# EAGLE design slave-v3 (EAGLE 5.10)
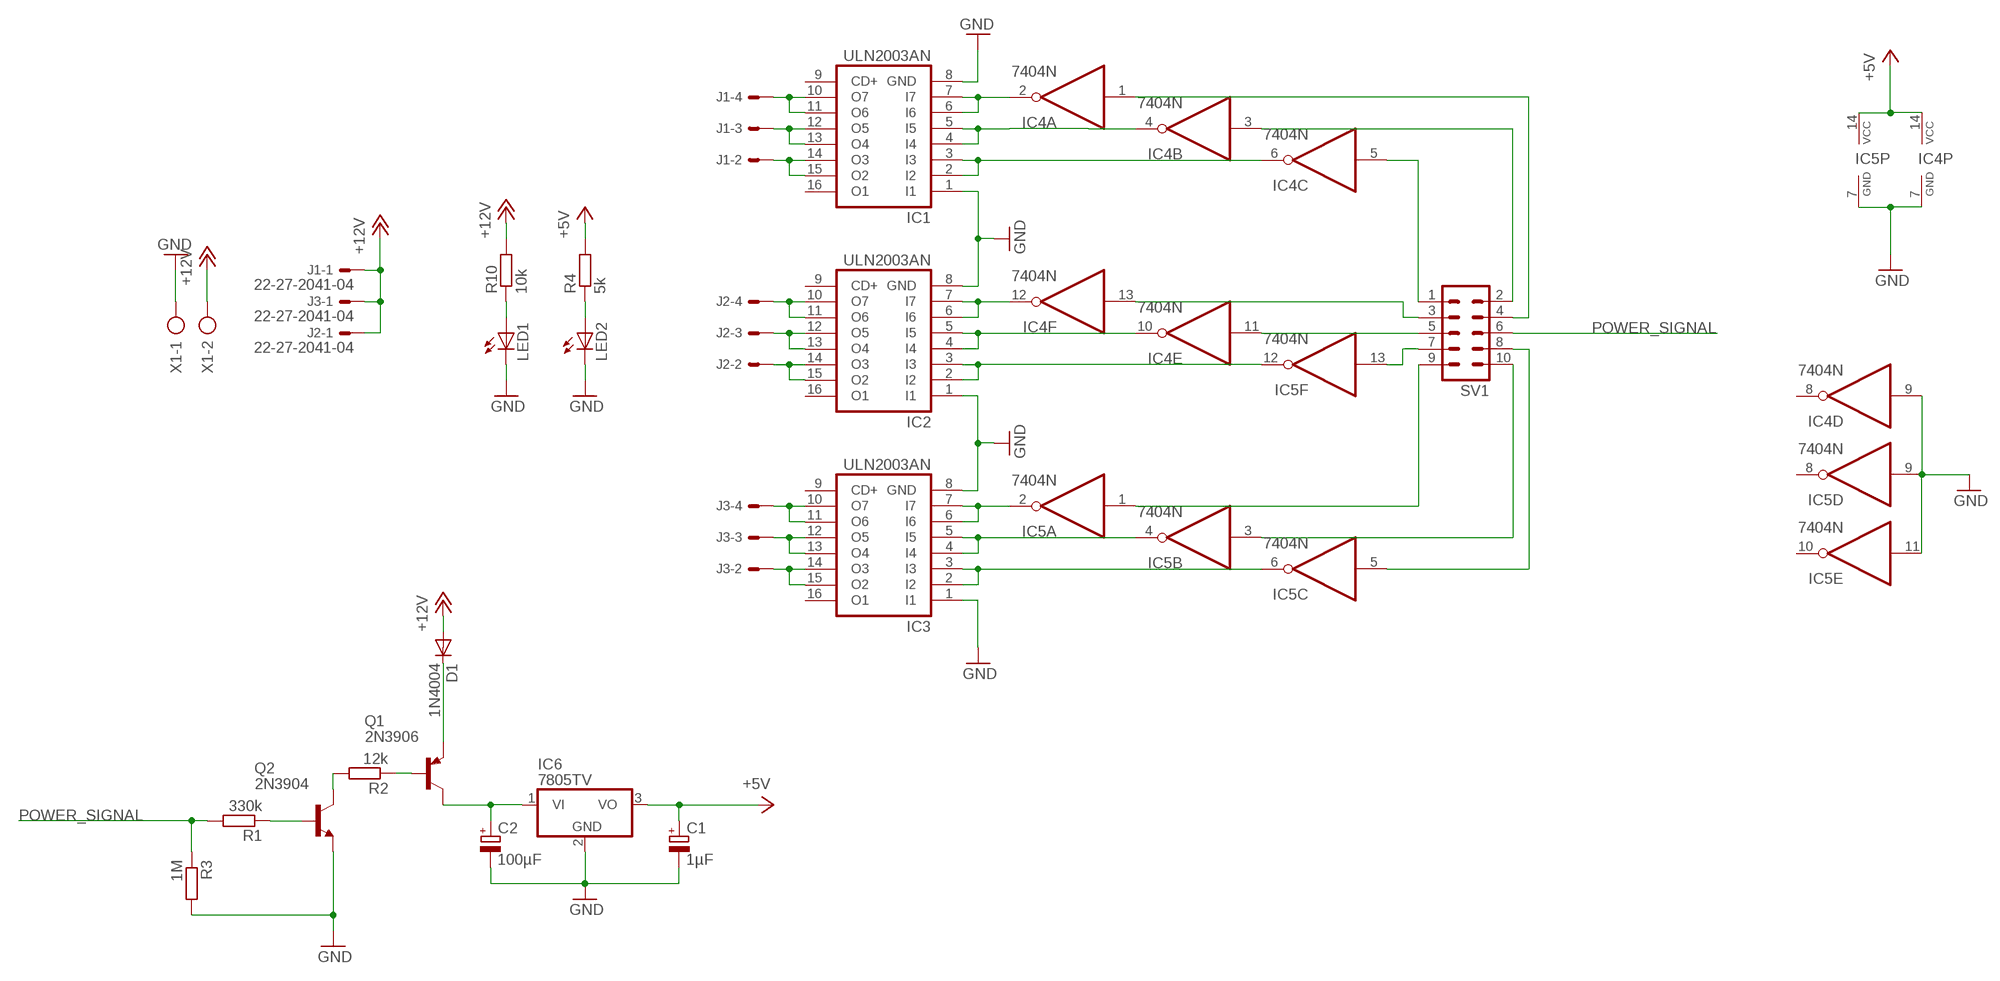
[diagram p0: schematic, sheet 1]

## Parts
C1  1µF  CPOL-EUE2.5-5  [E2,5-5]
C2  100µF  CPOL-EUE2.5-6  [E2,5-6]
D1  1N4004  [DO41-10]
IC1  ULN2003AN  [DIL16]
IC2  ULN2003AN  [DIL16]
IC3  ULN2003AN  [DIL16]
IC4  7404N  [DIL14]
IC5  7404N  [DIL14]
IC6  7805TV  [TO220V]
J1  22-27-2041-04  [6410-04]
J2  22-27-2041-04  [6410-04]
J3  22-27-2041-04  [6410-04]
LED1  LEDCHIPLED_1206  [CHIPLED_1206]
LED2  LEDCHIPLED_1206  [CHIPLED_1206]
Q1  2N3906  [TO92]
Q2  2N3904  [TO92]
R1  330k  R-EU_0204/7  [0204/7]
R2  12k  R-EU_M0805  [M0805]
R3  1M  R-EU_0204/7  [0204/7]
R4  5k  R-EU_M0805  [M0805]
R10  10k  R-EU_M0805  [M0805]
SV1  ML10  [ML10]
X1  AK500/2  [AK500/2]

## Nets
+5V: C1.+ IC4.14(P:VCC) IC5.14(P:VCC) IC6.3(VO) R4.2
+12V: D1.A J1.1 J2.1 J3.1 R10.2 X1.2
GND: C1.- C2.- IC1.1(I1) IC1.8(GND) IC2.1(I1) IC2.8(GND) IC3.1(I1) IC3.8(GND) IC4.7(P:GND) IC4.9(D:I) IC5.7(P:GND) IC5.9(D:I) IC5.11(E:I) IC6.2(GND) LED1.C LED2.C Q2.3(E) R3.2 X1.1
N$1: IC2.14(O3) IC2.15(O2) J2.2
N$2: IC2.12(O5) IC2.13(O4) J2.3
N$3: IC2.10(O7) IC2.11(O6) J2.4
N$4: IC1.14(O3) IC1.15(O2) J1.2
N$5: IC1.12(O5) IC1.13(O4) J1.3
N$6: IC1.10(O7) IC1.11(O6) J1.4
N$7: IC3.10(O7) IC3.11(O6) J3.4
N$8: IC3.12(O5) IC3.13(O4) J3.3
N$9: IC3.14(O3) IC3.15(O2) J3.2
N$10: IC5.13(F:I) SV1.7
N$11: IC4.11(E:I) SV1.5
N$12: IC4.13(F:I) SV1.3
N$13: IC4.5(C:I) SV1.1
N$14: IC4.1(A:I) SV1.4
N$15: IC4.3(B:I) SV1.2
N$16: IC1.6(I6) IC1.7(I7) IC4.2(A:O)
N$17: LED1.A R10.1
N$18: LED2.A R4.1
N$20: IC5.1(A:I) SV1.9
N$21: IC5.3(B:I) SV1.10
N$22: IC5.5(C:I) SV1.8
N$23: IC2.6(I6) IC2.7(I7) IC4.12(F:O)
N$26: IC3.6(I6) IC3.7(I7) IC5.2(A:O)
N$30: IC1.4(I4) IC1.5(I5) IC4.4(B:O)
N$31: IC1.2(I2) IC1.3(I3) IC4.6(C:O)
N$33: IC2.4(I4) IC2.5(I5) IC4.10(E:O)
N$34: IC2.2(I2) IC2.3(I3) IC5.12(F:O)
N$36: IC3.4(I4) IC3.5(I5) IC5.4(B:O)
N$37: IC3.2(I2) IC3.3(I3) IC5.6(C:O)
N$38: C2.+ IC6.1(VI) Q1.1(C)
N$39: D1.C Q1.3(E)
N$40: Q2.2(B) R1.1
N$41: Q1.2(B) R2.1
N$42: Q2.1(C) R2.2
POWER_SIGNAL: R1.2 R3.1 SV1.6
Unconnected: IC1.9(CD+) IC1.16(O1) IC2.9(CD+) IC2.16(O1) IC3.9(CD+) IC3.16(O1) IC4.8(D:O) IC5.8(D:O) IC5.10(E:O)

## Library data of the parts
C1 C2 = rcl:CPOL-EU: POLARIZED CAPACITOR, European symbol
D1 = diode:1N4004: DIODE general purpose rectifier, 1 A
IC1-IC3 = uln-udn:ULN2003A: DRIVER ARRAY
IC4 IC5 = 74xx-eu:74*04: Hex INVERTER
IC6 = linear:78*: Positive VOLTAGE REGULATOR Source: http://cache.national.com/ds/LM/LM78L05.pdf http://www.fairchildsemi.com/ds/LM/LM7805.pdf
J1-J3 = con-molex:22-?-04: CONNECTOR wire to board 2.54 mm (.1 inch) pitch header; OC_FARNELL: unknown; OC_NEWARK: unknown
LED1 LED2 = led:LED: LED OSRAM: - CHIPLED LG R971, LG N971, LY N971, LG Q971, LY Q971, LO R971, LY R971 LH N974, LH R974 LS Q976, LO Q976, LY Q976 LO Q996 - Hyper CHIPLED LW Q18S LB Q993, LB Q99A, LB R99A - SideLED LS A670, LO A670, LY A670, LG A670, LP A670 LB A673, LV A673, LT A673, LW A673 LH A674 LY A675 LS A676, LA A676, LO A676, LY A676, LW A676 LS A679, LY A679, LG A679 - Hyper Micro SIDELED® LS Y876, LA Y876, LO Y876, LY Y876 LT Y87S - SmartLED LW L88C, LW L88S LB L89C, LB L89S, LG L890 LS L89K, LO L89K, LY L89K LS L896, LA L896, LO L896, LY L896 - TOPLED LS T670, LO T670, LY T670, LG T670, LP T670 LSG T670, LSP T670, LSY T670, LOP T670, LYG T670 LG T671, LOG T671, LSG T671 LB T673, LV T673, LT T673, LW T673 LH T674 LS T676, LA T676, LO T676, LY T676, LB T676, LH T676, LSB T676, LW T676 LB T67C, LV T67C, LT T67C, LS T67K, LO T67K, LY T67K, LW E67C LS E67B, LA E67B, LO E67B, LY E67B, LB E67C, LV E67C, LT E67C LW T67C LS T679, LY T679, LG T679 LS T770, LO T770, LY T770, LG T770, LP T770 LB T773, LV T773, LT T773, LW T773 LH T774 LS E675, LA E675, LY E675, LS T675 LS T776, LA T776, LO T776, LY T776, LB T776 LHGB T686 LT T68C, LB T68C - Hyper Mini TOPLED® LB M676 - Mini TOPLED Santana® LG M470 LS M47K, LO M47K, LY M47K Source: http://www.osram.convergy.de LUXEON: - LUMILED® LXK2-PW12-R00, LXK2-PW12-S00, LXK2-PW14-U00, LXK2-PW14-V00 LXK2-PM12-R00, LXK2-PM12-S00, LXK2-PM14-U00 LXK2-PE12-Q00, LXK2-PE12-R00, LXK2-PE12-S00, LXK2-PE14-T00, LXK2-PE14-U00 LXK2-PB12-K00, LXK2-PB12-L00, LXK2-PB12-M00, LXK2-PB14-N00, LXK2-PB14-P00, LXK2-PB14-Q00 LXK2-PR12-L00, LXK2-PR12-M00, LXK2-PR14-Q00, LXK2-PR14-R00 LXK2-PD12-Q00, LXK2-PD12-R00, LXK2-PD12-S00 LXK2-PH12-R00, LXK2-PH12-S00 LXK2-PL12-P00, LXK2-PL12-Q00, LXK2-PL12-R00 Source: www.luxeon.com KINGBRIGHT: KA-3528ASYC Source: www.kingbright.com
Q1 = transistor-pnp:2N3906: PNP Transistor
Q2 = transistor-npn:2N3904: NPN Transistor
R1-R4 R10 = rcl:R-EU_: RESISTOR, European symbol
SV1 = con-ml:ML10: HARTING; OC_FARNELL: unknown; OC_NEWARK: unknown
X1 = con-ptr500:AK500/2: CONNECTOR; OC_FARNELL: unknown; OC_NEWARK: unknown

## Board
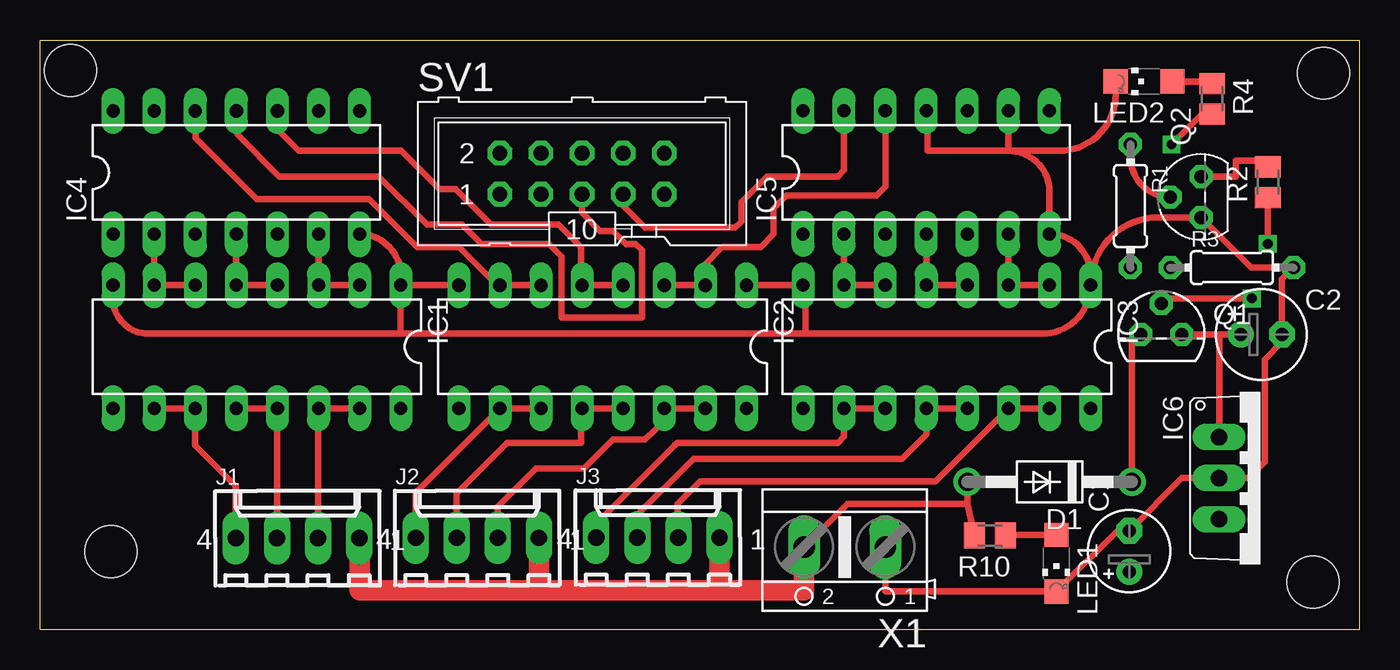
[diagram p1: board, top side]
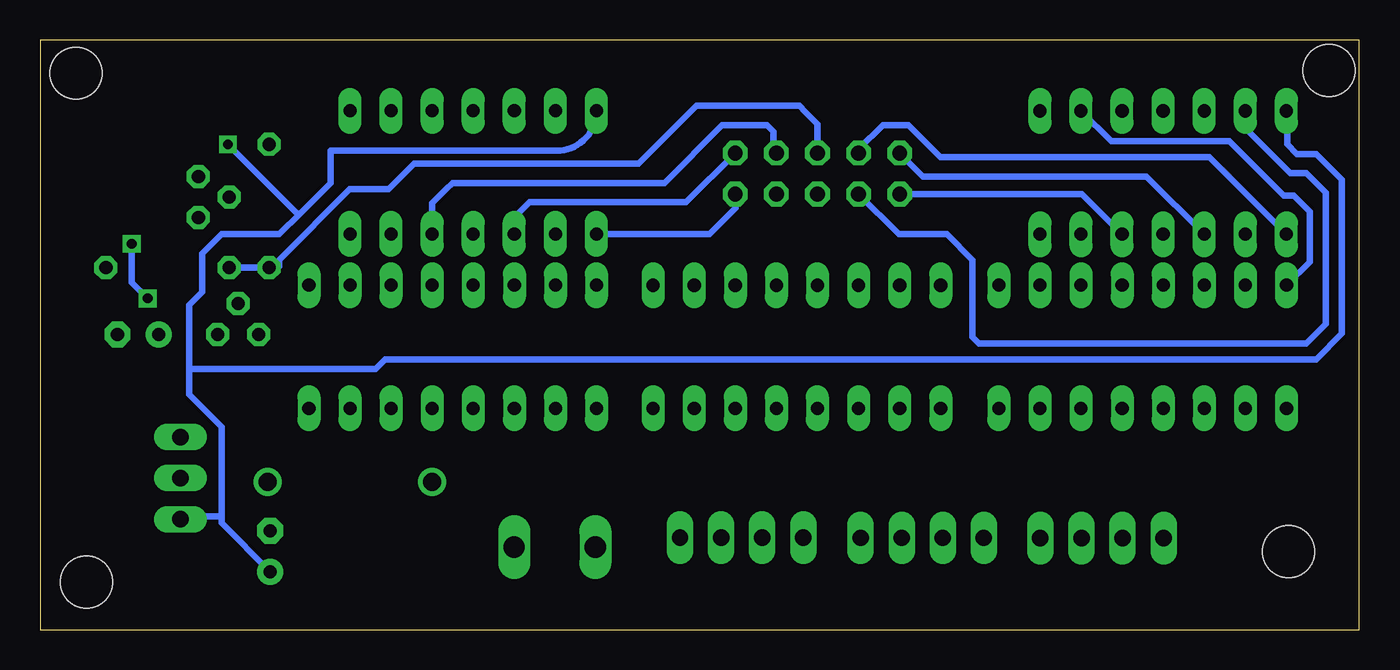
[diagram p2: board, bottom side, seen from below]

Size 81.52 x 36.43 mm. Coordinates in mm from the lower left corner, seen from the top.
Outline: 0,36.43 81.52,36.43 81.52,0 0,0 0,36.43
Copper layers (1*16): Top 0.035mm / dielectric 1.5mm / Bottom 0.035mm
Design rules "SparkFun": minimum track width 8mil, minimum drill 20mil, track to track 8mil, track to pad 8mil, pad to pad 8mil, via to via 8mil, smd to smd 8mil, copper to edge 10mil, drill to drill 8mil, minimum pad ring 12mil, minimum via ring 10mil, stop-mask expansion 4mil, vias tented up to drill 25mil, thermal gap 10mil
Holes 3.2 mm at 78.67,2.94 4.36,4.81 79.31,34.4 1.87,34.59

### Footprints (pad centres in the part's own frame; a part is rotated, then mirrored left to right if it is on the bottom)
E2,5-5 = drill 0.813 pad 1.6 round: + -1.27,0 | drill 0.813 pad 1.6 octagon: - 1.27,0
E2,5-6 = drill 0.813 pad 1.6 round: + -1.27,0 | drill 0.813 pad 1.6 octagon: - 1.27,0
DO41-10 = drill 1.118 round: A 5.08,0; C -5.08,0
DIL16 = drill 0.813 long: 1 -8.89,-3.81; 2 -6.35,-3.81; 3 -3.81,-3.81; 4 -1.27,-3.81; 5 1.27,-3.81; 6 3.81,-3.81; 7 6.35,-3.81; 8 8.89,-3.81; 9 8.89,3.81; 10 6.35,3.81; 11 3.81,3.81; 12 1.27,3.81; 13 -1.27,3.81; 14 -3.81,3.81; 15 -6.35,3.81; 16 -8.89,3.81
DIL14 = drill 0.813 long: 1 -7.62,-3.81; 2 -5.08,-3.81; 3 -2.54,-3.81; 4 0,-3.81; 5 2.54,-3.81; 6 5.08,-3.81; 7 7.62,-3.81; 8 7.62,3.81; 9 5.08,3.81; 10 2.54,3.81; 11 0,3.81; 12 -2.54,3.81; 13 -5.08,3.81; 14 -7.62,3.81
TO220V = drill 1.016 long: 1 -2.54,-2.54; 2 0,-2.54; 3 2.54,-2.54
6410-04 = drill 1.016 long: 1 3.81,0; 2 1.27,0; 3 -1.27,0; 4 -3.81,0
CHIPLED_1206 = smd 1.5 x 1.5: A 0,-1.75; C 0,1.75
TO92 = drill 0.813 octagon: 1 1.27,0; 2 0,1.905; 3 -1.27,0
0204/7 = drill 0.813 octagon: 1 -3.81,0; 2 3.81,0
M0805 = smd 1.3 x 1.6: 1 -0.95,0; 2 0.95,0
ML10 = drill 0.914 octagon: 1 -5.08,-1.27; 2 -5.08,1.27; 3 -2.54,-1.27; 4 -2.54,1.27; 5 0,-1.27; 6 0,1.27; 7 2.54,-1.27; 8 2.54,1.27; 9 5.08,-1.27; 10 5.08,1.27
AK500/2 = drill 1.321 long: 1 -2.515,0; 2 2.515,0

### Placement (x,y rotation side)
C1  67.31,4.84 90 top
C2  75.49,18.26 0 top
D1  62.39,9.13 180 top
IC1  13.38,17.48 180 top
IC2  34.75,17.48 180 top
IC3  56.03,17.49 180 top
IC4  12.11,28.26 0 top
IC5  54.76,28.27 0 top
IC6  75.41,9.37 270 top
J1  15.89,5.65 0 top
J2  27,5.67 0 top
J3  38.17,5.69 0 top
LED1  62.8,4.1 180 top
LED2  68.22,33.89 90 top
Q1  69.29,18.26 0 top
Q2  71.75,26.75 90 top
R1  67.39,26.19 270 top
R2  75.88,27.66 90 top
R3  73.66,22.38 0 top
R4  72.43,32.82 270 top
R10  58.69,5.82 180 top
SV1  33.48,28.2 0 top
X1  49.72,5.1 180 top

### Tracks (layer width: path | path; a pad name or v marks a point on that pad's centre or on a via)
+5V  (via drill 0.6)
  Top 0.406: R4.2 71.8,31.87 v69.93,30
  Bottom 0.406: IC5.14 arc90 49.62,29.61 63.58,29.61 63.58,27.62 65.46,25.74 | 65.46,25.74 66.75,24.45 70.33,24.45 71.52,23.26 71.52,20.88 72.31,20.08 72.31,16.11 | 72.31,16.11 72.31,14.53 70.33,12.54 70.33,6.98 | 70.33,6.98 70.33,6.59 C1.+ | IC6.3 72.87,6.98 70.33,6.98 | IC4.14 4.45,32.03 4.45,30 3.85,29.41 2.66,29.41 1.07,27.82 1.07,18.3 2.66,16.71 60.21,16.71 60.8,16.11 72.31,16.11 | v69.93,30 65.66,25.74 65.46,25.74
+12V
  Top 0.406: D1.A 57.29,9.13 57.29,7.78 | 57.29,7.78 R10.2 | X1.2 49.88,7.78 57.29,7.78
  Top 1.27: X1.2 47.21,2.42 41.98,2.42 | 30.82,2.42 19.73,2.42 19.73,5.65 J1.1 | 30.82,2.42 J2.1 | 30.82,2.42 41.95,2.42 41.98,2.42 | 41.98,2.42 J3.1
GND
  Top 0.406: IC4.7 arc-90 22.27,21.92 IC1.1 | IC3.1 64.92,21.92 arc90 IC5.7 62.38,27.07 arc90 59.84,29.61 | IC1.1 IC2.8 | IC2.8 | IC2.1 IC3.8 47.31,21.3 47.31,18.3 | IC3.1 64.92,21.03 | 22.27,18.3 6.69,18.3 arc-90 4.49,20.5 IC1.8 | 22.27,18.3 47.31,18.3 | 22.27,18.3 IC1.1 | 59.84,29.61 IC5.9 | 59.84,29.61 54.85,29.61 54.85,32.08 IC5.11 | X1.1 52.24,2.35 LED1.C 66.57,6.11 C1.- 70.56,9.37 IC6.2 74.69,9.37 75.68,10.36 75.68,16.71 76.76,17.78 C2.- 76.76,21.67 R3.2 74.85,22.38 Q2.3 69.1,25.48 arc90 IC3.1 | 47.31,18.3 61.92,18.3 arc90 IC3.1 | LED2.C 66.47,33.1 arc-90 62.98,29.61 59.84,29.61
  Bottom 0.406: IC4.9 15.32,30.2 8.02,30.2 4.64,26.83 4.05,26.83 3.06,25.84 3.06,22.73 IC1.8
N$1
  Top 0.406: IC2.15 IC2.14 38.56,12.92 37.98,12.34 | J2.2 28.26,5.69 28.26,7.58 30.64,9.96 33.62,9.96 35.4,11.75 37.39,11.75 37.98,12.34 | 37.98,12.34
N$2
  Top 0.406: IC2.13 IC2.12 33.42,13.61 33.42,11.55 28.85,11.55 25.74,8.43 J2.3
N$3
  Top 0.406: IC2.11 IC2.10 23.2,8.47 J2.4
N$4
  Top 0.406: IC1.15 IC1.14 17.16,13.65 J1.2
N$5
  Top 0.406: IC1.12 IC1.13 14.62,13.65 J1.3
N$6
  Top 0.406: IC1.10 IC1.11 9.57,11.39 12.08,8.87 J1.4
N$7
  Top 0.406: IC3.11 IC3.10 49.69,13.67 49.69,11.95 49.29,11.55 39.37,11.55 39.17,11.35 34.36,6.54 J3.4
N$8
  Top 0.406: IC3.13 IC3.12 54.76,12.06 53.26,10.56 40.36,10.56 36.79,6.98 36.79,5.8 J3.3
N$9
  Top 0.406: IC3.15 IC3.14 55.33,9.17 40.76,9.17 39.37,7.78 39.37,5.76 J3.2
N$10
  Top 0.406: IC5.13 49.69,28.42 49.29,28.02 44.93,28.02 43.34,26.43 43.34,25.24 42.94,24.84 37.39,24.84 36.02,26.21 SV1.7
N$11
  Top 0.406: SV1.5 33.48,25.77 34.61,24.65 35.4,24.65 36.2,23.85 36.79,23.85 37.19,23.46 37.19,19.29 32.23,19.29 32.23,23.06 31.43,23.85 27.27,23.85 26.08,25.04 23.89,25.04 20.92,28.02 14.76,28.02 12.18,30.6 12.18,32 IC4.11
N$12
  Bottom 0.406: SV1.3 28.46,24.45 25.48,24.45 23.89,22.86 23.89,18.1 23.5,17.7 3.25,17.7 2.06,18.89 2.06,27.03 3.25,28.22 4.25,28.22 7.03,31 IC4.13 7.03,31.4
N$13
  Bottom 0.406: SV1.1 17.13,26.93 IC4.5
N$14
  Bottom 0.406: IC4.1 9.25,29.21 25.88,29.21 27.86,31.19 29.45,31.19 30.94,29.7 SV1.4
N$15
  Bottom 0.406: IC4.3 13.14,28.02 26.95,28.02 SV1.2
N$16
  Top 0.406: IC4.2 IC1.7 IC1.6
N$17
  Top 0.406: LED1.A 60.12,5.85 R10.1
N$18
  Top 0.406: LED2.A 72.31,33.89 R4.1
N$20
  Bottom 0.406: SV1.9 38.56,26.05 40.16,24.45 47.13,24.45 IC5.1
N$21
  Bottom 0.406: IC5.3 52.22,25.48 51.28,26.43 41.6,26.43 SV1.10
N$22
  Bottom 0.406: IC5.5 57.3,26.36 56.44,27.23 | 56.44,27.23 | 56.44,27.23 56.04,27.62 42.94,27.62 39.37,31.19 36.59,31.19 36.2,30.8 36.2,29.64 SV1.8
N$23
  Top 0.406: IC2.6 IC2.7 28.4,21.52 28.01,21.52 25.88,23.65 23.3,23.65 20.32,26.63 13.38,26.63 9.6,30.4 9.6,32.04 IC4.12
N$26
  Top 0.406: IC3.6 IC3.7 IC5.2 arc-90 IC5.2
N$30
  Top 0.406: IC4.4 IC1.5 IC1.4
N$31
  Top 0.406: IC4.6 IC1.3 IC1.2
N$33
  Top 0.406: IC2.4 IC2.5 33.42,21.36 33.42,23.65 32.03,25.04 27.86,25.04 25.68,27.23 24.69,27.23 22.3,29.61 15.95,29.61 14.57,31 14.57,31.99 IC4.10
N$34
  Top 0.406: IC2.3 IC2.2 41.1,22.61 42.15,23.65 44.53,23.65 45.32,24.45 45.32,26.03 46.12,26.83 51.67,26.83 52.22,27.38 IC5.12
N$36
  Top 0.406: IC5.4 arc90 IC5.4 IC3.5 IC3.4
N$37
  Top 0.406: IC5.6 arc90 IC5.6 IC3.3 IC3.2
N$38
  Top 0.406: 72.87,18.26 Q1.1 | C2.+ 73.1,18.26 72.87,18.26 | IC6.1 72.87,18.26
N$39
  Top 0.406: Q1.3 67.47,17.7 D1.C
N$40
  Top 0.406: R1.1 67.39,29.21 arc90 Q2.2
N$41  (via drill 0.6)
  Top 0.406: Q1.2 69.61,20.48 v74.89,20.48 | v75.88,23.85 R2.1
  Bottom 0.406: v74.89,20.48 75.88,21.47 v75.88,23.85
N$42
  Top 0.406: Q2.1 73.9,28.02 73.9,29.01 75.88,29.01 R2.2
POWER_SIGNAL
  Bottom 0.406: SV1.6 33.48,31.26 34.21,31.99 | 34.21,31.99 | 34.21,31.99 34.61,32.38 40.96,32.38 44.53,28.81 58.42,28.81 60.01,27.23 62.39,27.23 66.75,22.86 66.75,22.46 67.31,22.46 R1.2 R3.1